# Altium project Main Board.PrjPcb
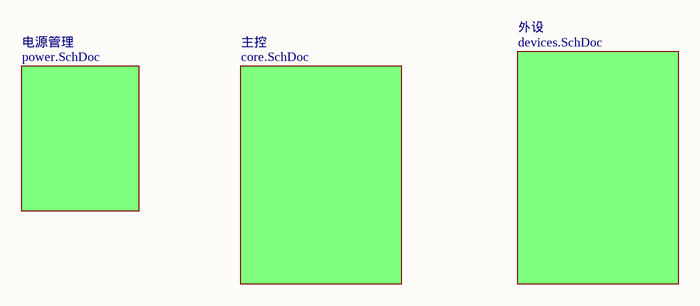
[diagram p0: main.SchDoc]
4 sheets, 70 parts. Net scope: flat (ports and power ports of the same name join across sheets).
Board file: main_board.PcbDoc
Sheets:
  main.SchDoc
    主控 = core.SchDoc
    电源管理 = power.SchDoc
    外设 = devices.SchDoc

## Sheet main.SchDoc
size A4

### Sub-sheets
主控 = core.SchDoc: no entries
外设 = devices.SchDoc: no entries
电源管理 = power.SchDoc: no entries

## Sheet core.SchDoc
size A4
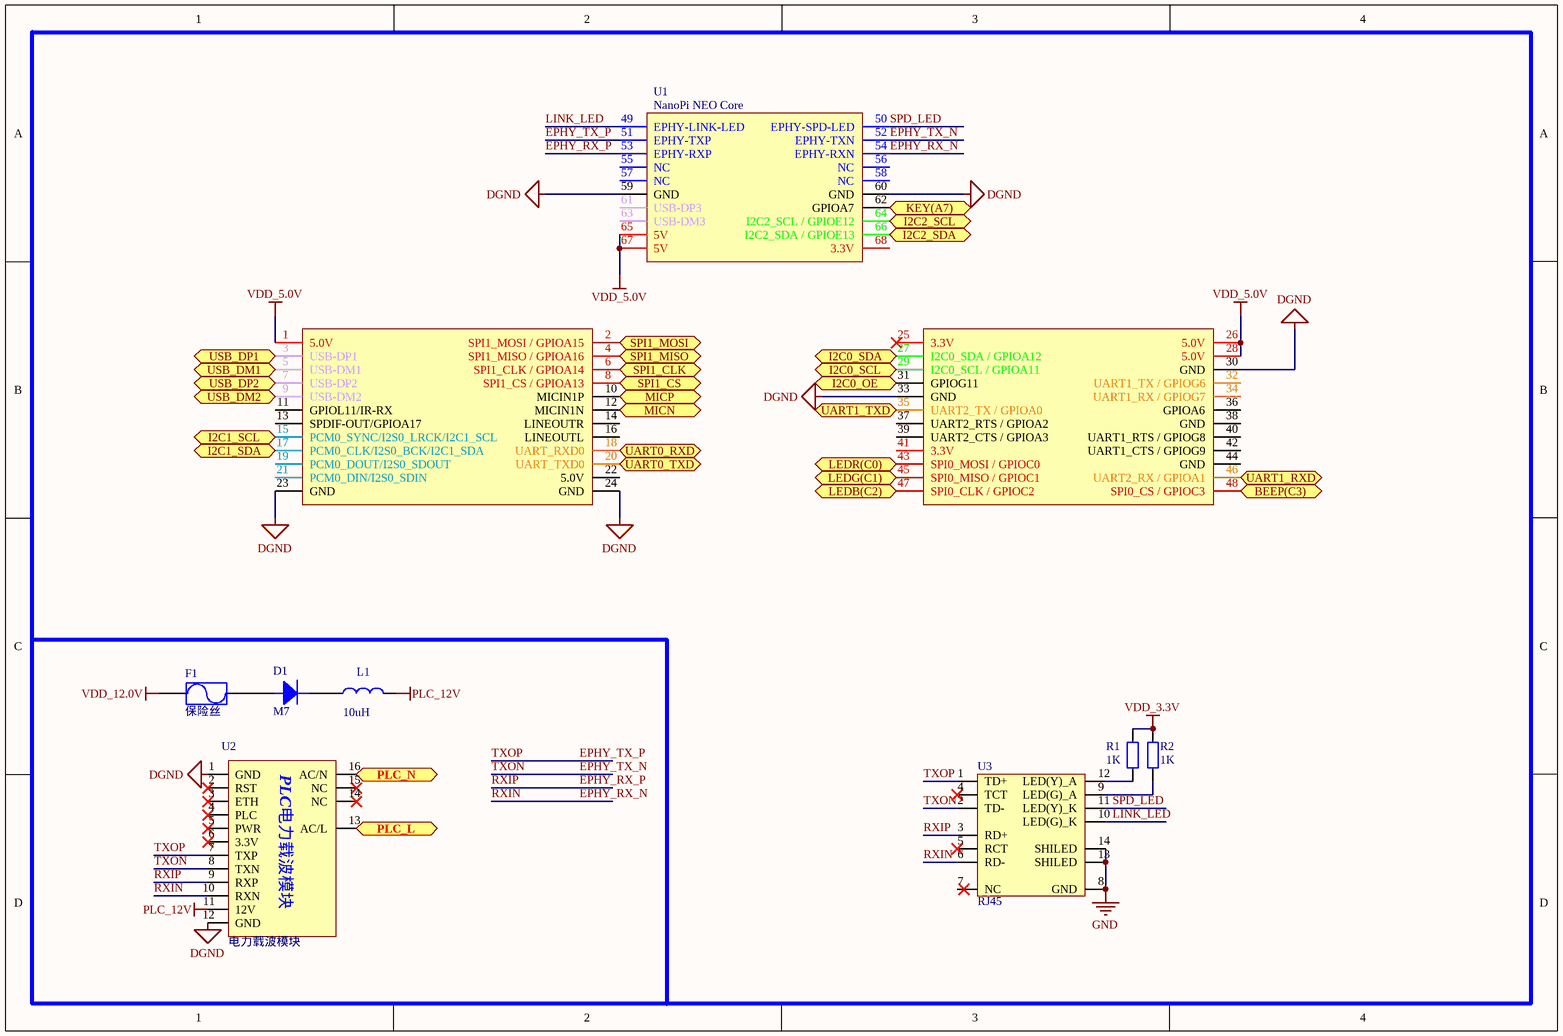
[diagram p1: core.SchDoc]

### Parts
D1  M7  [SMA/DO-214AC]
F1  保险丝  [1812]
L1  10uH  [1206L]
R1  1K  [0805R]
R2  1K  [0805R]
U1  NanoPi NEO Core  [NanoPi NEO Core]
U2  电力载波模块  [电力载波模块6410]
U3  RJ45  [RJ45]

### Ports
BEEP(C3), I2C0_OE, I2C0_SCL, I2C0_SDA, I2C1_SCL, I2C1_SDA, I2C2_SCL, I2C2_SDA, KEY(A7), LEDB(C2), LEDG(C1), LEDR(C0), MICN, MICP, PLC_L, PLC_N, SPI1_CLK, SPI1_CS, SPI1_MISO, SPI1_MOSI, UART0_RXD, UART0_TXD, UART1_RXD, UART1_TXD, USB_DM1, USB_DM2, USB_DP1, USB_DP2

### Nets
DGND: U1.23(GND) U1.24(GND) U1.30(GND) U1.33(GND) U1.59(GND) U1.60(GND) U2.1(GND) U2.12(GND)
GND: U2.16(AC/N) U3.8(GND) U3.13(SHILED) U3.14(SHILED) ; port PLC_N
PLC_12V: L1.2 U2.11(12V)
Power_24V: U2.13(AC/L) ; port PLC_L
VDD_3.3V: R1.1 R2.1
VDD_5.0V: U1.1(5.0V) U1.26(5.0V) U1.28(5.0V) U1.65(5V) U1.67(5V)
VDD_12.0V: F1.1
EPHY_RX_N: U1.54(EPHY-RXN) U2.10(RXN) U3.6(RD-)  [also labelled RXIN]
EPHY_RX_P: U1.53(EPHY-RXP) U2.9(RXP) U3.3(RD+)  [also labelled RXIP]
EPHY_TX_N: U1.52(EPHY-TXN) U2.8(TXN) U3.2(TD-)  [also labelled TXON]
EPHY_TX_P: U1.51(EPHY-TXP) U2.7(TXP) U3.1(TD+)  [also labelled TXOP]
LINK_LED: U1.49(EPHY-LINK-LED) U3.10(LED(G)_K)
SPD_LED: U1.50(EPHY-SPD-LED) U3.11(LED(Y)_K)
NetC2_2: U1.62(GPIOA7) ; port KEY(A7)
NetD1_1: D1.1 F1.2
NetD1_2: D1.2 L1.1
NetMIC1_1: U1.10(MICIN1P) ; port MICP
NetMIC1_2: U1.12(MICIN1N) ; port MICN
NetP1_2: U1.17(PCM0_CLK/I2S0_BCK/I2C1_SDA) ; port I2C1_SDA
NetP1_3: U1.15(PCM0_SYNC/I2S0_LRCK/I2C1_SCL) ; port I2C1_SCL
NetP2_3: U1.64(I2C2_SCL_/_GPIOE12) ; port I2C2_SCL
NetP2_4: U1.66(I2C2_SDA_/_GPIOE13) ; port I2C2_SDA
NetP3_2: U1.18(UART_RXD0) ; port UART0_RXD
NetP3_3: U1.20(UART_TXD0) ; port UART0_TXD
NetP4_2: U1.5(USB-DM1) ; port USB_DM1
NetP4_3: U1.3(USB-DP1) ; port USB_DP1
NetP5_2: U1.9(USB-DM2) ; port USB_DM2
NetP5_3: U1.7(USB-DP2) ; port USB_DP2
NetR1_2: R1.2 U3.12(LED(Y)_A)
NetR2_2: R2.2 U3.9(LED(G)_A)
NetR3_1: U1.47(SPI0_CLK_/_GPIOC2) ; port LEDB(C2)
NetR3_3: U1.45(SPI0_MISO_/_GPIOC1) ; port LEDG(C1)
NetR3_5: U1.43(SPI0_MOSI_/_GPIOC0) ; port LEDR(C0)
NetR3_7: U1.48(SPI0_CS_/_GPIOC3) ; port BEEP(C3)
NetR4_2: U1.6(SPI1_CLK_/_GPIOA14) ; port SPI1_CLK
NetR4_4: U1.8(SPI1_CS_/_GPIOA13) ; port SPI1_CS
NetR4_6: U1.2(SPI1_MOSI_/_GPIOA15) ; port SPI1_MOSI
NetR4_8: U1.4(SPI1_MISO_/_GPIOA16) ; port SPI1_MISO
NetR9_1: U1.27(I2C0_SDA_/_GPIOA12) ; port I2C0_SDA
NetR9_3: U1.29(I2C0_SCL_/_GPIOA11) ; port I2C0_SCL
NetR9_5: U1.31(GPIOG11) ; port I2C0_OE
NetU1_35: U1.35(UART2_TX_/_GPIOA0) ; port UART1_TXD
NetU1_46: U1.46(UART2_RX_/_GPIOA1) ; port UART1_RXD

Not connected (* = marked no-connect by the designer): U1 11(GPIOL11/IR-RX) 13(SPDIF-OUT/GPIOA17) 14(LINEOUTR) 16(LINEOUTL) 19(PCM0_DOUT/I2S0_SDOUT) 21(PCM0_DIN/I2S0_SDIN) 22(5.0V) 25(3.3V)* 32(UART1_TX_/_GPIOG6) 34(UART1_RX_/_GPIOG7) 36(GPIOA6) 37(UART2_RTS_/_GPIOA2) 38(GND) 39(UART2_CTS_/_GPIOA3) 40(UART1_RTS_/_GPIOG8) 41(3.3V) 42(UART1_CTS_/_GPIOG9) 44(GND) 55(NC) 56(NC) 57(NC) 58(NC) 61(USB-DP3) 63(USB-DM3) 68(3.3V); U2 2(RST)* 3(ETH)* 4(PLC)* 5(PWR)* 6(3.3V)* 14(NC)* 15(NC)*; U3 4(TCT)* 5(RCT)* 7(NC)

### Notes on the sheet
- (in symbol 电力载波模块6410) PLC电力载波模块

### Library data of the parts
D1 = Diode: 二极管
F1 = Fuse
L1 = L: 电感
R1 R2 = Res: 电阻
U2 = 电力载波模块6410

## Sheet power.SchDoc
size A4
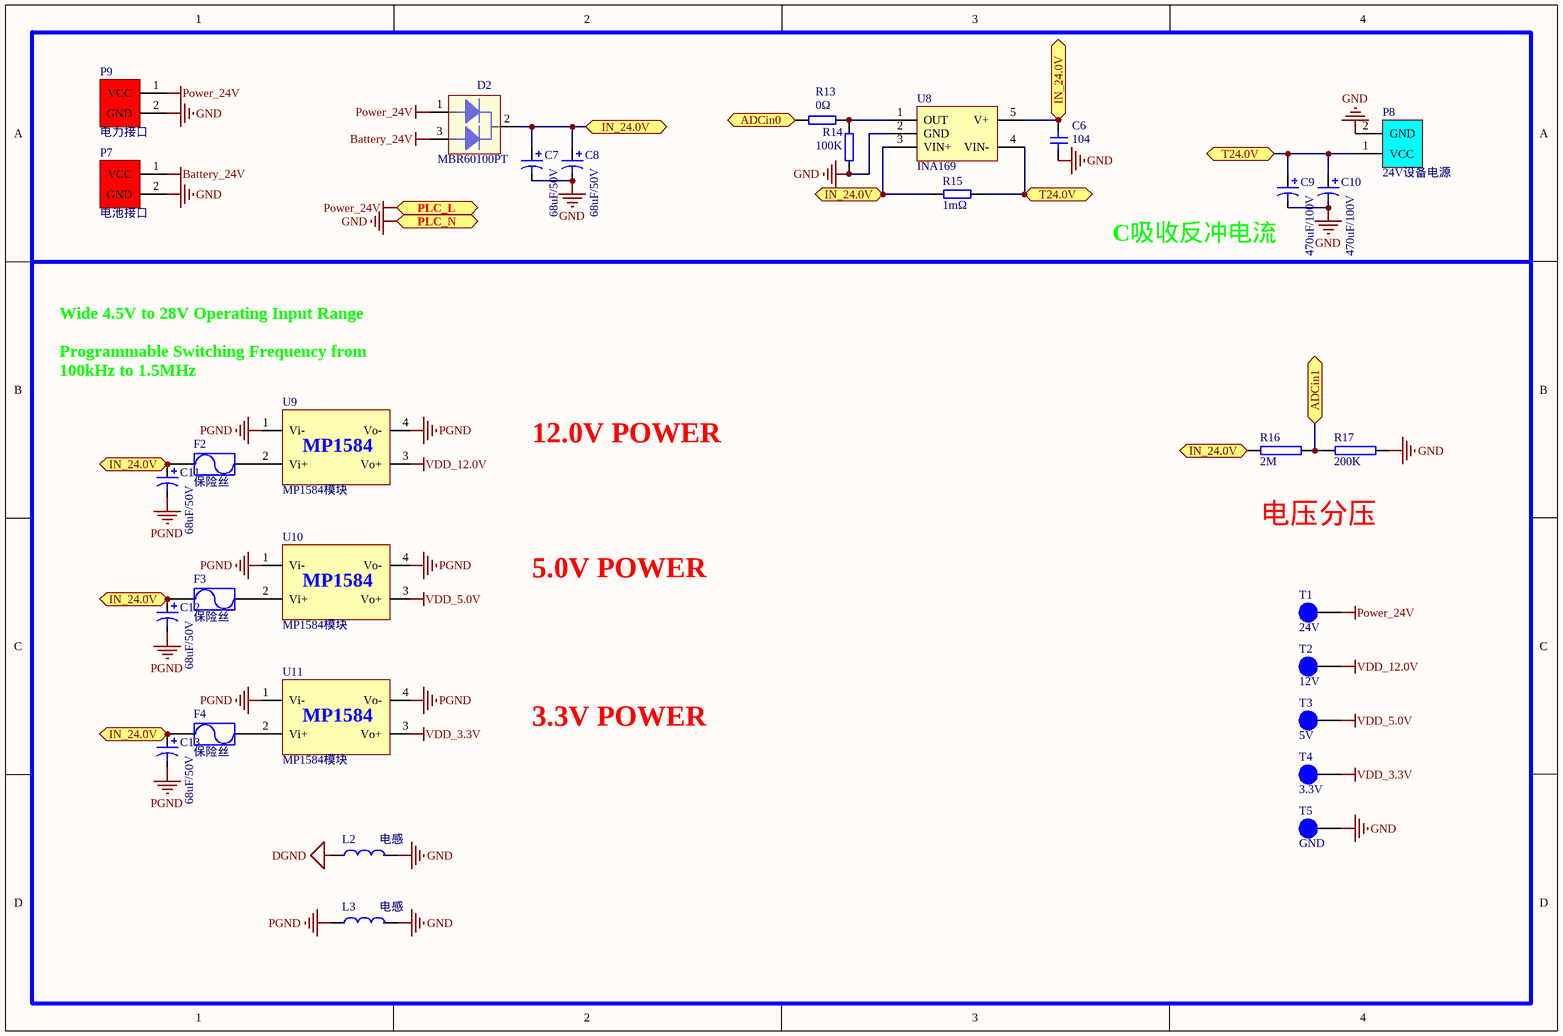
[diagram p2: power.SchDoc]

### Parts
C6  104  [0805C]
C7  68uF/50V  [RB.2.4]
C8  68uF/50V  [RB.2.4]
C9  470uF/100V  [RB.1.2]
C10  470uF/100V  [RB.1.2]
C11  68uF/50V  [RB.1.2]
C12  68uF/50V  [RB.1.2]
C13  68uF/50V  [RB.1.2]
D2  MBR60100PT  [TO-247LS]
F2  保险丝  [FUSE-1812]
F3  保险丝  [FUSE-1812]
F4  保险丝  [FUSE-1812]
L2  电感  [1206L]
L3  电感  [1206L]
P7  电池接口  [XT60-F]
P8  24V设备电源  [XT60-F]
P9  电力接口  [XT60-F]
R13  0Ω  [0805R]
R14  100K  [0805R]
R15  1mΩ  [2512R]
R16  2M  [0805R]
R17  200K  [0805R]
T1  24V  [HEADER 1]
T2  12V  [HEADER 1]
T3  5V  [HEADER 1]
T4  3.3V  [HEADER 1]
T5  GND  [HEADER 1]
U8  INA169  [SOT23-5]
U9  MP1584模块  [MP1584电源模块]
U10  MP1584模块  [MP1584电源模块]
U11  MP1584模块  [MP1584电源模块]

### Ports
ADCin0, ADCin1, IN_24.0V, PLC_L, PLC_N, T24.0V

### Nets
Battery_24V: D2.3 P7.1(VCC)
DGND: L2.1
GND: C6.1 C7.2 C8.2 C9.2 C10.2 L2.2 L3.2 P7.2(GND) P8.2(GND) P9.2(GND) R14.2 R17.2 T5.1 U8.2(GND) ; port PLC_N
PGND: C11.2 C12.2 C13.2 L3.1 U9.1(Vi-) U9.4(Vo-) U10.1(Vi-) U10.4(Vo-) U11.1(Vi-) U11.4(Vo-)
Power_24V: D2.1 P9.1(VCC) T1.1 ; port PLC_L
VDD_3.3V: T4.1 U11.3(Vo+)
VDD_5.0V: T3.1 U10.3(Vo+)
VDD_12.0V: T2.1 U9.3(Vo+)
NetC3_2: R16.2 R17.1 ; port ADCin1
NetC4_2: R13.1 ; port ADCin0
NetC6_2: C6.2 C7.1 C8.1 C11.1 C12.1 C13.1 D2.2 F2.1 F3.1 F4.1 R15.2 R16.1 U8.3(VIN+) U8.5(V+) ; port IN_24.0V
NetC9_1: C9.1 C10.1 P8.1(VCC) R15.1 U8.4(VIN-) ; port T24.0V
NetF2_2: F2.2 U9.2(Vi+)
NetF3_2: F3.2 U10.2(Vi+)
NetF4_2: F4.2 U11.2(Vi+)
NetR13_2: R13.2 R14.1 U8.1(OUT)

### Notes on the sheet
- C吸收反冲电流
- (near U9) Wide 4.5V to 28V Operating Input Range
  Programmable Switching Frequency from
  100kHz to 1.5MHz
- 12.0V POWER
- 5.0V POWER
- 电压分压
- 3.3V POWER
- (in symbol MP1584电源模块) MP1584

### Library data of the parts
C6 = Cap1: 无极贴片电容
C7-C13 = Cap3: 直插极性电容
F2-F4 = Fuse
L2 L3 = L
P7 P9 = 电源端子
P8 = 推进器电源
R13-R15 = Res: 电阻
R16 R17 = R1
T1-T5 = 测试点
U9-U11 = MP1584电源模块

## Sheet devices.SchDoc
size A4
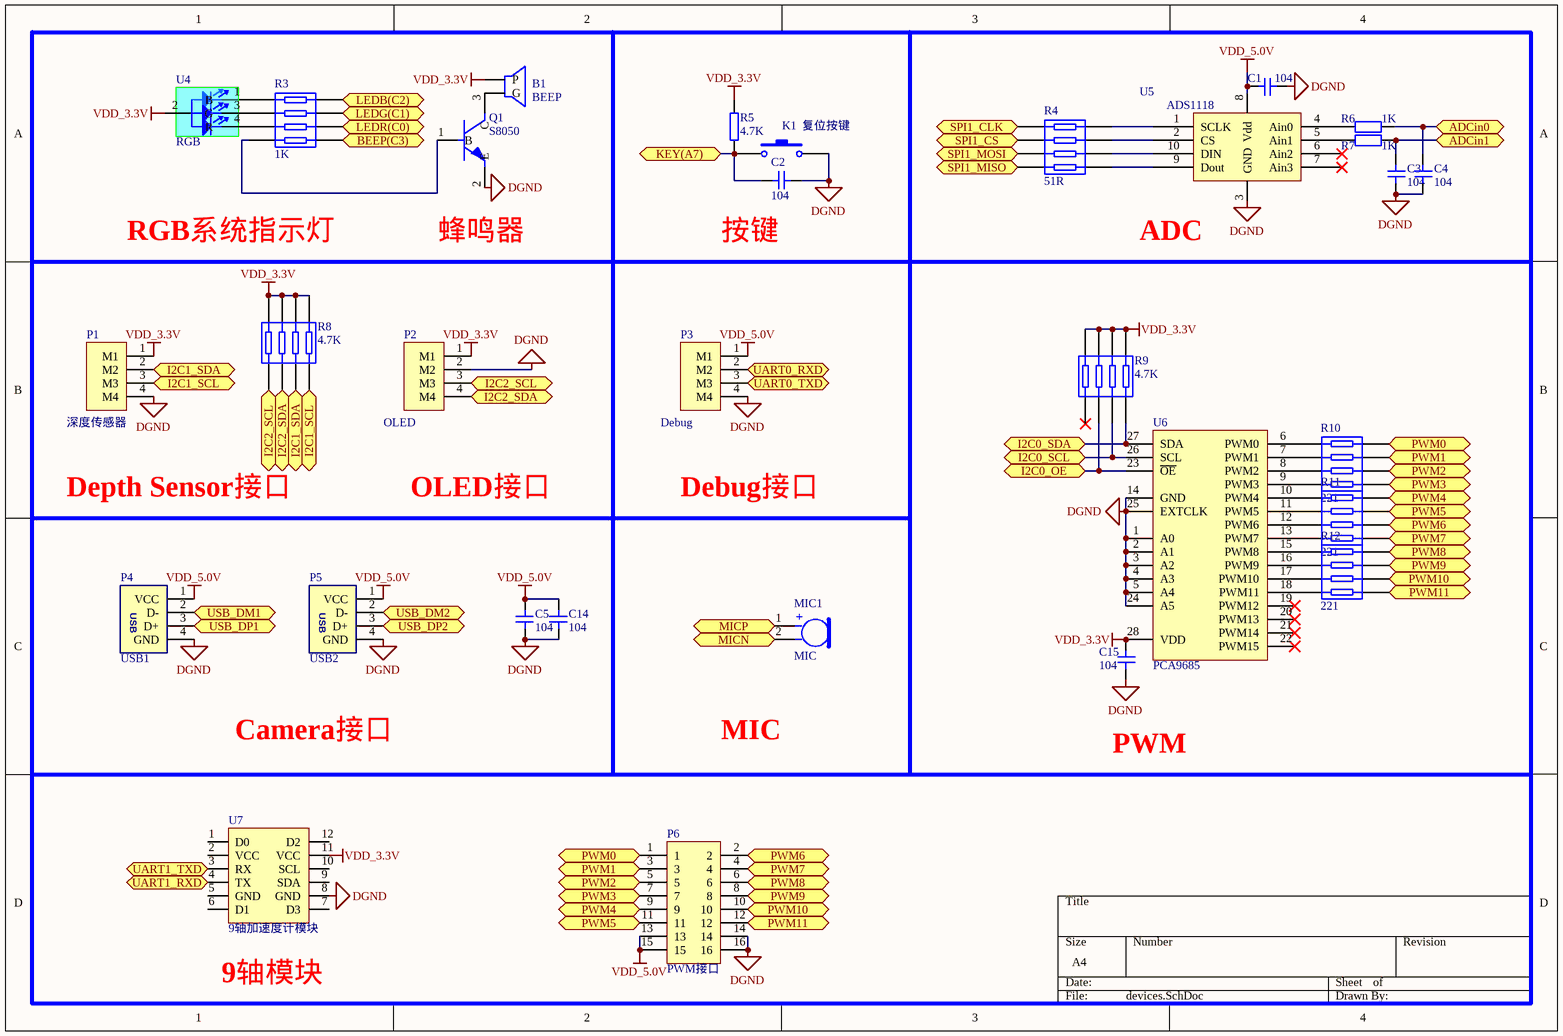
[diagram p3: devices.SchDoc]

### Parts
B1  BEEP  [BUZZER]
C1  104  [0805C]
C2  104  [0805C]
C3  104  [0805C]
C4  104  [0805C]
C5  104  [0805C]
C14  104  [0805C]
C15  104  [0805C]
K1  复位按键  [贴片按键]
MIC1  MIC  [MIC]
P1  深度传感器  [MX1.25S-4P]
P2  OLED  [MX1.25S-4P]
P3  Debug  [MX1.25S-4P]
P4  USB1  [PH2.0S-4P]
P5  USB2  [PH2.0S-4P]
P6  PWM接口  [HDR2X8/2.54-SMD]
Q1  S8050  [SOT-23]
R3  1K  [排阻(4位贴片)]
R4  51R  [排阻(4位贴片)]
R5  4.7K  [0805R]
R6  1K  [0805R]
R7  1K  [0805R]
R8  4.7K  [排阻(4位贴片)]
R9  4.7K  [排阻(4位贴片)]
R10  221  [排阻(4位贴片)]
R11  221  [排阻(4位贴片)]
R12  221  [排阻(4位贴片)]
U4  RGB  [RGB-3528]
U5  ADS1118  [VSSOP-10]
U6  PCA9685  [TSSOP-28]
U7  9轴加速度计模块  [9轴加速度计]

### Ports
ADCin0, ADCin1, BEEP(C3), I2C0_OE, I2C0_SCL, I2C0_SDA, I2C1_SCL, I2C1_SDA, I2C2_SCL, I2C2_SDA, KEY(A7), LEDB(C2), LEDG(C1), LEDR(C0), MICN, MICP, PWM0, PWM0 (out), PWM1, PWM2, PWM3, PWM4, PWM5, PWM6, PWM7, PWM8, PWM9, PWM10, PWM11, SPI1_CLK, SPI1_CS, SPI1_MISO, SPI1_MOSI, UART0_RXD, UART0_TXD, UART1_RXD, UART1_TXD, USB_DM1, USB_DM2, USB_DP1, USB_DP2

### Nets
DGND: C1.2 C2.1 C3.1 C4.1 C5.2 C14.2 C15.1 K1.2 P1.4(M4) P2.2(M2) P3.4(M4) P4.4(GND) P5.4(GND) P6.14 P6.16 Q1.2(E) U5.3(GND) U6.1(A0) U6.2(A1) U6.3(A2) U6.4(A3) U6.5(A4) U6.14(GND) U6.24(A5) U6.25(EXTCLK) U7.8(GND)
VDD_3.3V: B1.1(P) C15.2 P1.1(M1) P2.1(M1) R5.2 R8.2 R8.4 R8.6 R8.8 R9.2 R9.4 R9.6 R9.8 U4.2 U6.28(VDD) U7.11(VCC)
VDD_5.0V: C1.1 C5.1 C14.1 P3.1(M1) P4.1(VCC) P5.1(VCC) P6.13 P6.15 U5.8(Vdd)
NetB1_2: B1.2(G) Q1.3(C)
NetC2_2: C2.2 K1.1 R5.1 ; port KEY(A7)
NetC3_2: C3.2 R7.2 ; port ADCin1
NetC4_2: C4.2 R6.2 ; port ADCin0
NetMIC1_1: MIC1.1(P) ; port MICP
NetMIC1_2: MIC1.2(N) ; port MICN
NetP1_2: P1.2(M2) R8.5 ; port I2C1_SDA
NetP1_3: P1.3(M3) R8.7 ; port I2C1_SCL
NetP2_3: P2.3(M3) R8.1 ; port I2C2_SCL
NetP2_4: P2.4(M4) R8.3 ; port I2C2_SDA
NetP3_2: P3.2(M2) ; port UART0_RXD
NetP3_3: P3.3(M3) ; port UART0_TXD
NetP4_2: P4.2(D-) ; port USB_DM1
NetP4_3: P4.3(D+) ; port USB_DP1
NetP5_2: P5.2(D-) ; port USB_DM2
NetP5_3: P5.3(D+) ; port USB_DP2
NetP6_1: P6.1 R10.8 ; port PWM0
NetP6_2: P6.2 R11.4 ; port PWM6
NetP6_3: P6.3 R10.6 ; port PWM1
NetP6_4: P6.4 R11.2 ; port PWM7
NetP6_5: P6.5 R10.4 ; port PWM2
NetP6_6: P6.6 R12.8 ; port PWM8
NetP6_7: P6.7 R10.2 ; port PWM3
NetP6_8: P6.8 R12.6 ; port PWM9
NetP6_9: P6.9 R11.8 ; port PWM4
NetP6_10: P6.10 R12.4 ; port PWM10
NetP6_11: P6.11 R11.6 ; port PWM5
NetP6_12: P6.12 R12.2 ; port PWM11
NetQ1_1: Q1.1(B) R3.8
NetR3_1: R3.1 ; port LEDB(C2)
NetR3_2: R3.2 U4.1(B)
NetR3_3: R3.3 ; port LEDG(C1)
NetR3_4: R3.4 U4.3(G)
NetR3_5: R3.5 ; port LEDR(C0)
NetR3_6: R3.6 U4.4(R)
NetR3_7: R3.7 ; port BEEP(C3)
NetR4_1: R4.1 U5.1(SCLK)
NetR4_2: R4.2 ; port SPI1_CLK
NetR4_3: R4.3 U5.2(CS)
NetR4_4: R4.4 ; port SPI1_CS
NetR4_5: R4.5 U5.10(DIN)
NetR4_6: R4.6 ; port SPI1_MOSI
NetR4_7: R4.7 U5.9(Dout)
NetR4_8: R4.8 ; port SPI1_MISO
NetR6_1: R6.1 U5.4(Ain0)
NetR7_1: R7.1 U5.5(Ain1)
NetR9_1: R9.1 U6.27(SDA) ; port I2C0_SDA
NetR9_3: R9.3 U6.26(SCL) ; port I2C0_SCL
NetR9_5: R9.5 U6.23(~{OE}) ; port I2C0_OE
NetR10_1: R10.1 U6.9(PWM3)
NetR10_3: R10.3 U6.8(PWM2)
NetR10_5: R10.5 U6.7(PWM1)
NetR10_7: R10.7 U6.6(PWM0)
NetR11_1: R11.1 U6.13(PWM7)
NetR11_3: R11.3 U6.12(PWM6)
NetR11_5: R11.5 U6.11(PWM5)
NetR11_7: R11.7 U6.10(PWM4)
NetR12_1: R12.1 U6.18(PWM11)
NetR12_3: R12.3 U6.17(PWM10)
NetR12_5: R12.5 U6.16(PWM9)
NetR12_7: R12.7 U6.15(PWM8)
NetU1_35: U7.3(RX) ; port UART1_TXD
NetU1_46: U7.4(TX) ; port UART1_RXD

Not connected (* = marked no-connect by the designer): R9 7*; U5 6(Ain2)* 7(Ain3)*; U6 19(PWM12)* 20(PWM13)* 21(PWM14)* 22(PWM15)*; U7 1(D0) 2(VCC) 5(GND) 6(D1) 7(D3) 9(SDA) 10(SCL) 12(D2)

### Notes on the sheet
- RGB系统指示灯
- (near Q1) 蜂鸣器
- 按键
- (near U5) ADC
- Depth Sensor接口
- OLED接口
- Debug接口
- Camera接口
- MIC
- PWM
- (near U7) 9轴模块
- (in symbol MIC) +

### Library data of the parts
C1-C5 C14 C15 = Cap1: 无极贴片电容
K1 = 贴片按键: 轻触开关
P1-P3 = 接线端子-4PIN: 4PIN
P4 P5 = USB
P6 = Header 2X8
Q1 = NPN: NPN三极管
R3 R4 R8-R12 = Res-4: 排阻
R5-R7 = Res: 电阻
U7 = 9轴加速度计

## Nets that join several sheets
DGND: core (8 pins), power (L2.1), devices (26 pins)
GND: core (U2.16 U3.8 U3.13 U3.14), power (14 pins)
Power_24V: core (U2.13), power (D2.1 P9.1 T1.1)
VDD_3.3V: core (R1.1 R2.1), power (T4.1 U11.3), devices (16 pins)
VDD_5.0V: core (5 pins), power (T3.1 U10.3), devices (9 pins)
VDD_12.0V: core (F1.1), power (T2.1 U9.3)
NetC2_2: core (U1.62), devices (C2.2 K1.1 R5.1)
NetC3_2: power (R16.2 R17.1), devices (C3.2 R7.2)
NetC4_2: power (R13.1), devices (C4.2 R6.2)
NetMIC1_1: core (U1.10), devices (MIC1.1)
NetMIC1_2: core (U1.12), devices (MIC1.2)
NetP1_2: core (U1.17), devices (P1.2 R8.5)
NetP1_3: core (U1.15), devices (P1.3 R8.7)
NetP2_3: core (U1.64), devices (P2.3 R8.1)
NetP2_4: core (U1.66), devices (P2.4 R8.3)
NetP3_2: core (U1.18), devices (P3.2)
NetP3_3: core (U1.20), devices (P3.3)
NetP4_2: core (U1.5), devices (P4.2)
NetP4_3: core (U1.3), devices (P4.3)
NetP5_2: core (U1.9), devices (P5.2)
NetP5_3: core (U1.7), devices (P5.3)
NetR3_1: core (U1.47), devices (R3.1)
NetR3_3: core (U1.45), devices (R3.3)
NetR3_5: core (U1.43), devices (R3.5)
NetR3_7: core (U1.48), devices (R3.7)
NetR4_2: core (U1.6), devices (R4.2)
NetR4_4: core (U1.8), devices (R4.4)
NetR4_6: core (U1.2), devices (R4.6)
NetR4_8: core (U1.4), devices (R4.8)
NetR9_1: core (U1.27), devices (R9.1 U6.27)
NetR9_3: core (U1.29), devices (R9.3 U6.26)
NetR9_5: core (U1.31), devices (R9.5 U6.23)
NetU1_35: core (U1.35), devices (U7.3)
NetU1_46: core (U1.46), devices (U7.4)